# EasyEDA Pro project sony_flash.eprj

# Schematic Schematic1
Board Name: Board1; Create Date: 2025-09-22; Page Name: P1; Project Name: sony_flash; Schematic Name: Schematic1; Update Date: 2025-10-10; Company: 嘉立创EDA; Page Size: A4; Version: V1.0
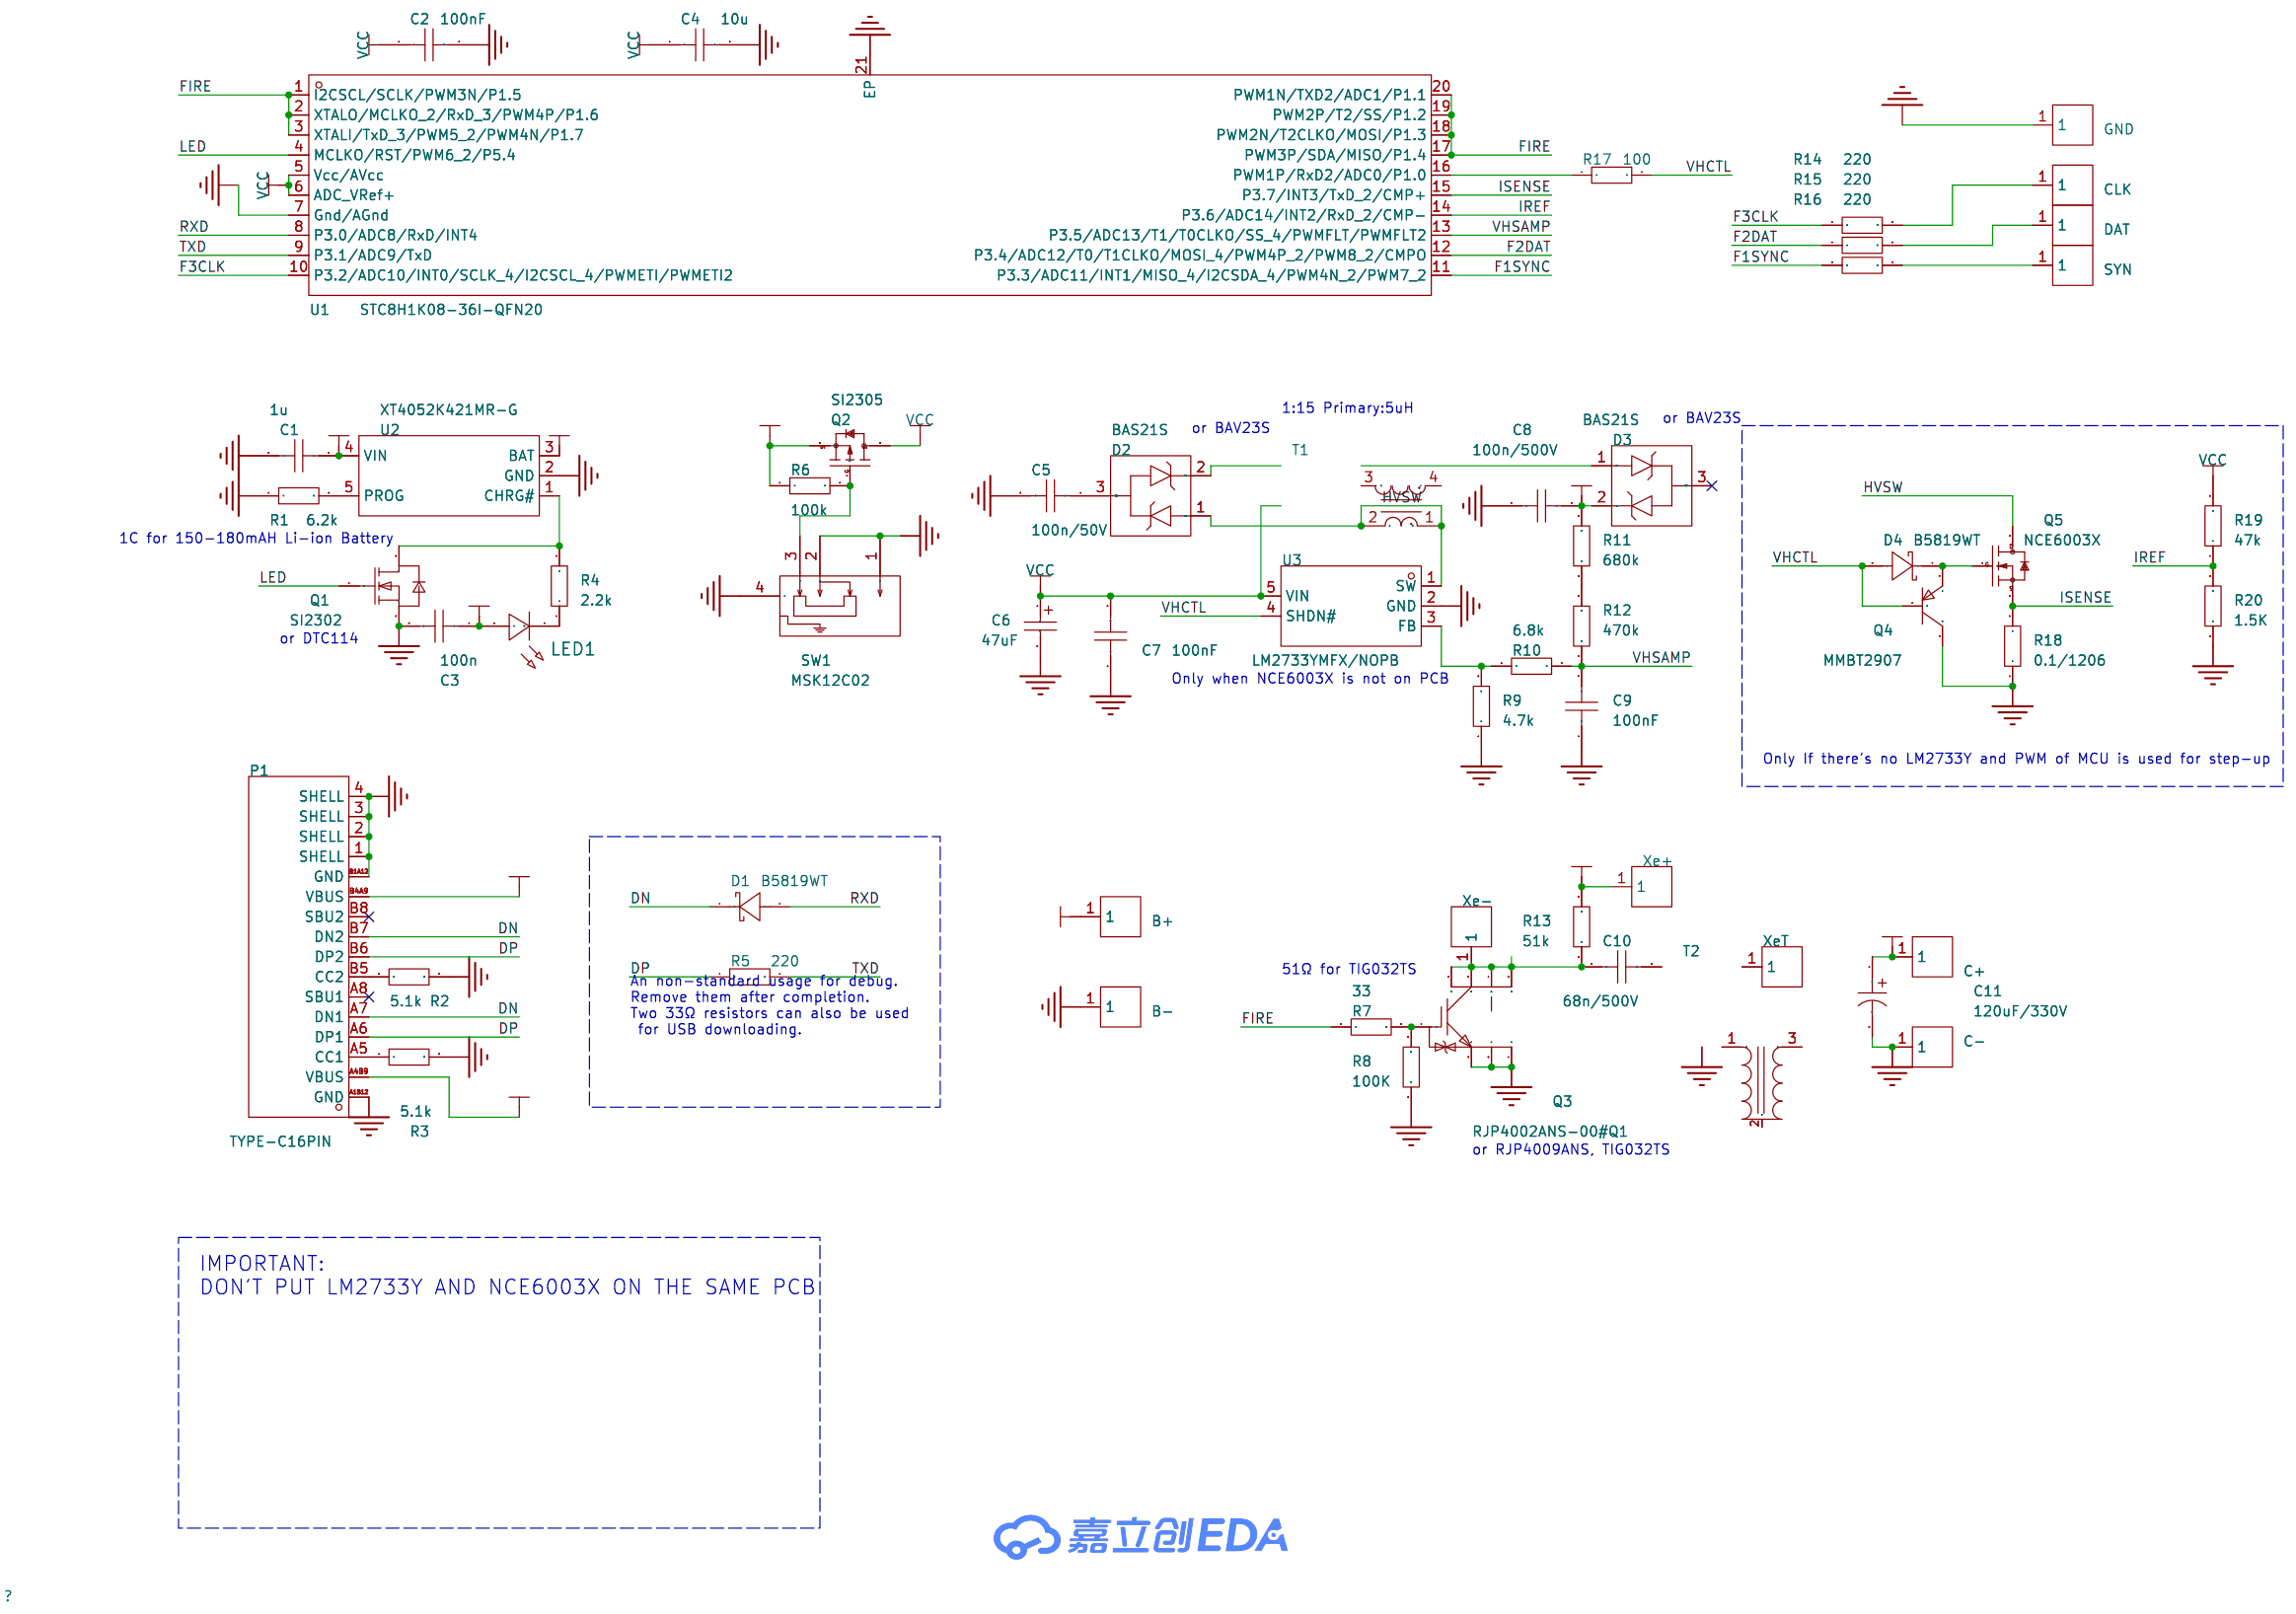
[diagram p0: schematic sheet]

## Parts
B+  PAD  [pad-1.5mm]
B-  PAD  [pad-1.5mm]
C1  1u  [C0603]
C2  100nF  [C0603]
C3  100n  [C0603]
C4  10u  [C0603]
C5  100n/50V  [C0603]
C6  47uF  [CASE-A_3216]
C7  100nF  [C0603]
C8  100n/500V  [C1206]
C9  100nF  [C0603]
C10  68n/500V  [C1206]
C11  120uF/330V  [CAP-TH_BD13.0-P5.00-D0.6-FD]
C+  PAD  [pad-1.5mm]
C-  PAD  [pad-1.5mm]
CLK  PAD  [pad-0.8x0.8]
D1  B5819WT  [SOD-523_L1.2-W0.8-LS1.6-RD]
D2  BAS21S  [SOT-23_L2.9-W1.3-P1.90-LS2.4-BL]
D3  BAS21S  [SOT-23_L2.9-W1.3-P1.90-LS2.4-BL]
D4  B5819WT  [SOD-523_L1.2-W0.8-LS1.6-RD]
DAT  PAD  [pad-0.8x0.8]
GND  PAD  [pad-0.8x0.8]
LED1  -  [LED_0603]
P1  TYPE-C16PIN  [USB-C-SMD_TYPE-C16PIN]
Q1  SI2302  [SOT-23-3_L2.9-W1.3-P0.95-LS2.4-BR]
Q2  SI2305  [SOT-23-3_L2.9-W1.3-P1.90-LS2.4-BR]
Q3  RJP4002ANS-00#Q1  [VSON-8_L4.4-W3.0-P0.65-LS4.8-BL]
Q4  MMBT2907  [SOT-23-3_L2.9-W1.3-P1.90-LS2.4-BR]
Q5  NCE6003X  [SOT-23-3_L2.9-W1.3-P1.90-LS2.4-BR]
R1  6.2k  [R0603]
R2  5.1k  [R0603]
R3  5.1k  [R0603]
R4  2.2k  [R0603]
R5  220  [R0603]
R6  100k  [R0603]
R7  33  [R0603]
R8  100K  [R0603]
R9  4.7k  [R0603]
R10  6.8k  [R0603]
R11  680k  [R0603]
R12  470k  [R0603]
R13  51k  [R0603]
R14  220  [R0603]
R15  220  [R0603]
R16  220  [R0603]
R17  100  [R0603]
R18  0.1/1206  [R1206]
R19  47k  [R0603]
R20  1.5K  [R0603]
SW1  MSK12C02  [SW-TH_MSK12C02]
SYN  PAD  [pad-0.8x0.8]
T1  -  [NA5924-AR]
T2  -  [TTRG-HF8124]
U1  STC8H1K08-36I-QFN20  [QFN-20_L3.0-W3.0-P0.40-BL-EP1.7]
U2  XT4052K421MR-G  [SOT-23-5_L2.9-W1.6-P0.95-LS2.8-BL]
U3  LM2733YMFX/NOPB  [SOT-23-5_L3.0-W1.7-P0.95-LS2.8-BL]
Xe+  PAD  [pad-1.5mm]
Xe-  PAD  [pad-1.5mm]
XeT  PAD  [pad-1.5mm]

## Library data of the parts
B+ B- C+ C- CLK DAT GND SYN Xe+ Xe- XeT = PAD: Supplier Part: C9900017271; JLCPCB Part Class: Extended Part; Supplier: LCSC
C1-C5 C7-C10 = CAP_0603: Supplier Footprint: 0603
C6 = TAJA476K006RNJ: LCSC Part Name: 47uF ±10% 6.3V; Supplier Part: C7190; Manufacturer: Kyocera AVX; Supplier Footprint: CASE-A-3216-18(mm); JLCPCB Part Class: 扩展库; Supplier: LCSC; Tolerance: ±10%; Voltage Rating: 6.3V; Equivalent Series Resistance(ESR): 1.6Ω@100kHz; Operating Temperature: -55℃~+125℃
C11 = 87EC0555: LCSC Part Name: 120uF ±20% 400V; Supplier Part: C19708144; Manufacturer: KNSCHA(科尼盛); Supplier Footprint: 插件,D13xL35mm; JLCPCB Part Class: 扩展库; Datasheet: https://item.szlcsc.com/datasheet/87EC0555/21016187.html; Supplier: LCSC; Tolerance: ±20%; Voltage Rating: 400V; Ripple Current: 750mA@120Hz; Pin Spacing: 5mm; Diameter: 13mm; Height - Seated (Max): 35mm; Lifetime: 2000hrs@105℃; Operating Temperature: -25℃~+105℃
D1 D4 = B5819WT_C7502714: LCSC Part Name: 电压:40V 电流:0.35A; Supplier Part: C7502714; Manufacturer: R+O(宏嘉诚); Supplier Footprint: SOD-523; JLCPCB Part Class: 扩展库; Datasheet: https://item.szlcsc.com/datasheet/B5819WT/8589431.html; Supplier: LCSC; Diode Configuration: 独立式; Voltage - Forward(Vf@If): 600mV@200mA; Voltage - DC Reverse(Vr): 40V; Current - Rectified: 350mA; Reverse Leakage Current (Ir): 5uA@30V; Non-Repetitive Peak Forward Surge Current: 1.5A
D2 D3 = BAS21S: Supplier Part: C2846050; Manufacturer: UMW(友台半导体); Supplier Footprint: SOT-23; JLCPCB Part Class: 扩展库; Datasheet: https://item.szlcsc.com/datasheet/BAS21S/3039891.html; Supplier: LCSC; Diode Configuration: 1对串联式; Voltage - Forward(Vf@If): 1.25V@200mA; Voltage - DC Reverse(Vr): 250V; Current - Rectified: 200mA; Pd - Power Dissipation: 225mW; Reverse Leakage Current (Ir): 100nA@200V; Reverse Recovery Time (trr): 50ns; Non-Repetitive Peak Forward Surge Current: 2.5A
LED1 = LED_0603-R: Supplier Footprint: 0603
P1 = TYPE-C16PIN: LCSC Part Name: Type-C 母 卧贴; Supplier Part: C393939; Manufacturer: SHOU HAN(首韩); Supplier Footprint: SMD; JLCPCB Part Class: 扩展库; Datasheet: https://item.szlcsc.com/datasheet/TYPE-C16PIN/372551.html; Supplier: LCSC; Connector Type: Type-C; Protocol Standard: USB 3.1; Gender: 母; Mounting Type: 卧贴; Number of Contacts: 16P; Number of Ports: 1; Current Rating-Power: 3A; Voltage Rating: 30V; Connect-Disconnect Life: 1万次; Detection color: 黑色; Operating Temperature: -40℃~+85℃
Q1 = SI2302_C9900175661: Supplier Part: C9900175661; Supplier Footprint: SOT-23; Supplier: LCSC
Q2 = SI2305_C181088: LCSC Part Name: 1个P沟道 耐压:12V 电流:4.1A; Supplier Part: C181088; Manufacturer: Hottech(合科泰); Supplier Footprint: SOT-23; JLCPCB Part Class: 扩展库; Datasheet: https://item.szlcsc.com/datasheet/SI2305/192485.html; Supplier: LCSC; Number: 1个P沟道; Drain to Source Voltage: 12V; Current - Continuous Drain(Id): 4.1A; RDS(on): 45mΩ@4.5V,3.5A; Pd - Power Dissipation: 350mW; Gate Threshold Voltage (Vgs(th)): 900mV@250uA; Gate Charge(Qg): 15nC@4.5V; Input Capacitance(Ciss): 740pF; Operating Temperature: -55℃~+150℃; Output Capacitance(Coss): 290pF
Q3 = RJP4002ANS-00#Q1: Supplier Part: C3171294; Manufacturer: RENESAS(瑞萨)/IDT; JLCPCB Part Class: 扩展库; Supplier: LCSC
Q4 = MMBT2907_C2891811: LCSC Part Name: PNP 电流:0.6A 电压:60V; Supplier Part: C2891811; Manufacturer: YONGYUTAI(永裕泰); Supplier Footprint: SOT-23; JLCPCB Part Class: 扩展库; Datasheet: https://item.szlcsc.com/datasheet/MMBT2907/3119730.html; Supplier: LCSC; type: PNP; Current - Collector(Ic): 600mA; Collector - Emitter Voltage VCEO: 60V; Pd - Power Dissipation: 225mW; DC Current Gain: 400@150mA,10V; Current - Collector Cutoff: 1uA; Vce Saturation(VCE(sat)): 400mV@150mA,15mA; Emitter-Base Voltage(Vebo): 5V; Number: 1个PNP
Q5 = NCE6003X: LCSC Part Name: 1个N沟道 耐压:60V 电流:3A; Supplier Part: C2934580; Manufacturer: NCE(无锡新洁能); Supplier Footprint: SOT-23; JLCPCB Part Class: 扩展库; Datasheet: https://item.szlcsc.com/datasheet/NCE6003X/3281457.html; Supplier: LCSC; Number: 1个N沟道; Drain to Source Voltage: 60V; Current - Continuous Drain(Id): 3A; RDS(on): 110mΩ@4.5V; Pd - Power Dissipation: 1.7W; Gate Threshold Voltage (Vgs(th)): 2V@250uA; Gate Charge(Qg): 10.2nC@10V; Operating Temperature: -55℃~+150℃; Type: N沟道
R1-R20 = Res_0603: Supplier Footprint: 0603
SW1 = MSK12C02: LCSC Part Name: 两档侧拨贴片 7脚 滑动开关; Supplier Part: C431540; Manufacturer: SHOU HAN(首韩); Supplier Footprint: SMD,8x2.8mm; JLCPCB Part Class: 扩展库; Datasheet: https://item.szlcsc.com/datasheet/MSK12C02/427897.html; Supplier: LCSC; Circuit: 单刀双掷; Termination Style: SMD接片; Length: 8mm; Width: 2.8mm; Switch Height: 1.4mm; Mounting Type: 卧贴; Current Rating: 50mA; Voltage Rating: 12V; Life: 1万次; Operating Temperature: -20℃~+70℃
T1 = NA5924-AR
T2 = TTRG-HF8124
U1 = STC8H1K08-36I-QFN20: LCSC Part Name: 宽电压/高速/高可靠/低功耗/强抗静电/较强抗干扰的新一代 8051 单片机; Supplier Part: C915674; Manufacturer: STC; Supplier Footprint: QFN-20-EP(3x3); JLCPCB Part Class: 扩展库; Datasheet: https://atta.szlcsc.com/upload/public/pdf/source/20241226/4D2D43D1C972E3DE0CD105735CEEAD95.pdf; Supplier: LCSC; CPU Core: 51系列; Program Storage Size: 8KB; Program Memory Type: FLASH; Number of I/O: 17; ADC (Bit): 10bit; PWM (Bit): 16bit; Low Voltage Detection Threshold: 1.9V~5.5V
U2 = XT4052K421MR-G: Supplier Part: C219048; Manufacturer: natlinear(南麟); Supplier Footprint: SOT-23-5L; JLCPCB Part Class: 扩展库; Supplier: LCSC
U3 = LM2733YMFX/NOPB: LCSC Part Name: 0.6至1.6MHz升压转换器，内置40V FET开关，采用SOT-23封装; Supplier Part: C527399; Manufacturer: TI(德州仪器); Supplier Footprint: SOT-23-5; JLCPCB Part Class: 扩展库; Datasheet: https://www.ti.com/cn/lit/gpn/lm2733; Supplier: LCSC; Function: 升压型; Voltage - Supply: 2.7V~14V; Output Voltage: 2.7V~40V; Output Current: 1A; Frequency - Switching: 600kHz; Operating Temperature: -40℃~+125℃@(TJ); Synchronous Rectifier: 否; Number of Outputs: 1; Topology: 升压式; Quiescent Current: 1.1mA; Switch tube (built-in/external): 内置; Output Type: 可调

## Nets
GND: B-.1 C1.2 C2.2 C3.2 C4.2 C5.2 C6.2 C7.1 C8.1 C9.1 C11.2 C-.1 GND.1 P1.1(SHELL) P1.2(SHELL) P1.3(SHELL) P1.4(SHELL) P1.A1B12(GND) P1.B1A12(GND) Q1.2(S) Q3.1(E) Q3.2(E) Q3.3(E) Q4.3(C) R1.1 R2.2 R3.2 R8.1 R9.1 R18.1 R20.1 SW1.1 SW1.2 SW1.4 U1.7(Gnd/AGnd) U1.21(EP) U2.2(GND) U3.2(GND)
VBAT: B+.1 C3.1 LED1.2(A) Q2.2(S) R6.1 U2.3(BAT)
VBUS: C1.1 P1.A4B9(VBUS) P1.B4A9(VBUS) U2.4(VIN)
VCC: C2.1 C4.1 C6.1 C7.2 Q2.3(D) R19.2 U1.5(Vcc/AVcc) U1.6(ADC_VRef+) U3.5(VIN)
DN: D1.1(K) P1.A7(DN1) P1.B7(DN2)
DP: P1.A6(DP1) P1.B6(DP2) R5.1
F1SYNC: R16.1 U1.11(P3.3/ADC11/INT1/MISO_4/I2CSDA_4/PWM4N_2/PWM7_2)
F2DAT: R15.1 U1.12(P3.4/ADC12/T0/T1CLKO/MOSI_4/PWM4P_2/PWM8_2/CMPO)
F3CLK: R14.1 U1.10(P3.2/ADC10/INT0/SCLK_4/I2CSCL_4/PWMETI/PWMETI2)
FIRE: R7.1 U1.1(I2CSCL/SCLK/PWM3N/P1.5) U1.2(XTALO/MCLKO_2/RxD_3/PWM4P/P1.6) U1.3(XTALI/TxD_3/PWM5_2/PWM4N/P1.7) U1.17(PWM3P/SDA/MISO/P1.4) U1.18(PWM2N/T2CLKO/MOSI/P1.3) U1.19(PWM2P/T2/SS/P1.2) U1.20(PWM1N/TXD2/ADC1/P1.1)
HVSW: D2.1(BASE) Q5.3(D) T1.1 T1.2 U3.1(SW)
IREF: R19.1 R20.2 U1.14(P3.6/ADC14/INT2/RxD_2/CMP-)
ISENSE: Q5.2(S) R18.2 U1.15(P3.7/INT3/TxD_2/CMP+)
LED: Q1.1(G) U1.4(MCLKO/RST/PWM6_2/P5.4)
RXD: D1.2(A) U1.8(P3.0/ADC8/RxD/INT4)
TXD: R5.2 U1.9(P3.1/ADC9/TxD)
VH: C8.2 C11.1 C+.1 D3.2(EMITTER) R11.2 R13.2 Xe+.1
VHCTL: D4.2(A) Q4.1(B) R17.2 U3.4(SHDN#)
VHSAMP: C9.2 R10.2 R12.1 U1.13(P3.5/ADC13/T1/T0CLKO/SS_4/PWMFLT/PWMFLT2)
$1N1176: P1.B5(CC2) R2.1
$1N1202: P1.A5(CC1) R3.1
$1N1568: R1.2 U2.5(PROG)
$1N2100: Q1.3(D) R4.2 U2.1(CHRG#)
$1N2340: C10.1 Q3.5(C) Q3.6(C) Q3.7(C) Q3.8(C) R13.1 Xe-.1
$1N2369: Q3.4(G) R7.2 R8.2
$1N3948: R9.2 R10.1 U3.3(FB)
$1N4269: CLK.1 R14.2
$1N4295: DAT.1 R15.2
$1N4321: R16.2 SYN.1
$1N12535: D4.1(K) Q4.2(E) Q5.1(G)
$1N13636: R11.1 R12.2
$1N13640: C5.1 D2.3(COLLECTOR)
$1N18562: LED1.1(C) R4.1
$1N23434: R17.1 U1.16(PWM1P/RxD2/ADC0/P1.0)
$1N28292: Q2.1(G) R6.2 SW1.3

Not connected (* = marked no-connect by the designer): C10 2; D2 2(EMITTER); D3 1(BASE) 3(COLLECTOR)*; P1 A8(SBU1)* B8(SBU2)*; T1 3 4; T2 1 2 3; XeT 1

## Notes on the sheet
- 1:15 Primary:5uH
- or BAV23S
- or BAV23S
- 1C for 150-180mAH Li-ion Battery
- or DTC114
- Only when NCE6003X is not on PCB
- Only If there's no LM2733Y and PWM of MCU is used for step-up
- 51Ω for TIG032TS
- An non-standard usage for debug.
  Remove them after completion.
  Two 33Ω resistors can also be used
   for USB downloading.
- or RJP4009ANS, TIG032TS
- IMPORTANT:
  DON'T PUT LM2733Y AND NCE6003X ON THE SAME PCB

# Board PCB1
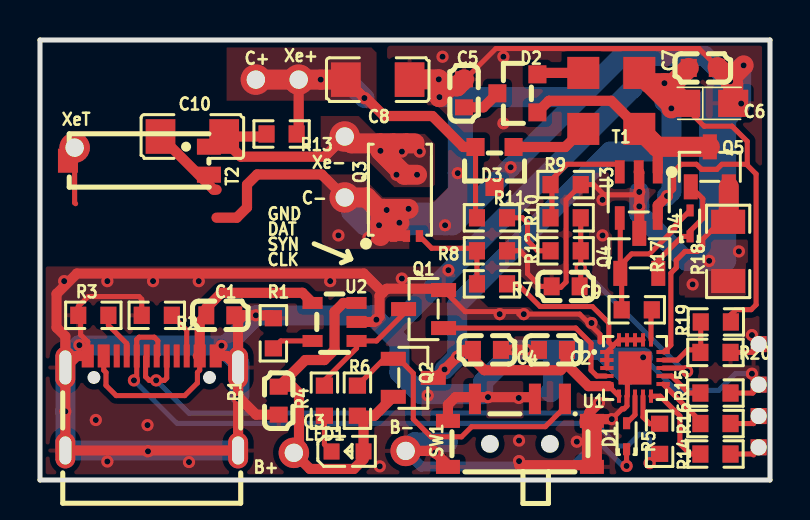
[diagram p1: board, top side]
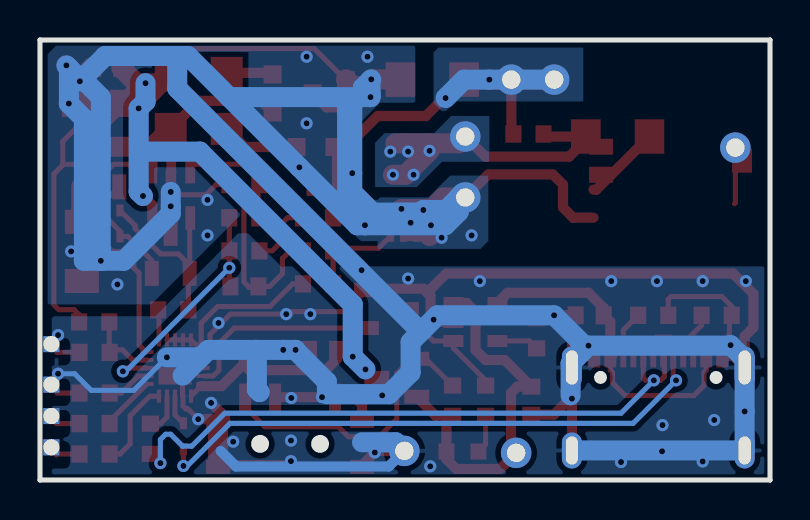
[diagram p2: board, bottom side, seen from below]

Outline 36.51 x 22 mm; copper layers: Top Layer, Bottom Layer. Coordinates in mm from the lower left corner of the outline.
Outline path: 0,22 0,0 36.51,0 36.51,22 0,22
Stack: Top Layer 0.035mm / Dielectric1 1.51mm FR4 er 4.5 / Bottom Layer 0.035mm

## Design rules (mm)
net DN: DP1
net DP: DP1
template: JLCPCB Capability(Two Layers Board)
spacing copperThickness1oz (default): track to track 0.102, other pairs 0.152 to 0.3
spacing copperThickness2oz: track to track 0.203, other pairs 0.152 to 0.3
track width copperThickness1oz (default): min 0.127, default 0.254, max 2.54
track width copperThickness2oz: min 0.203, default 0.254, max 2.54
differential pair differentialPair (default): width min 0.127, default 0.254, max 2.54; gap min 0.152, default 0.152
via viaSize (default): diameter min 0.5, default 0.61, max 10; hole min 0.3, default 0.305, max 6.3

## Placement (name value [footprint] x y rotation side)
B+  PAD  [pad-1.5mm]  12.7 1.36 0 top
B-  PAD  [pad-1.5mm]  18.29 1.45 0 top
C1  1u  [C0603]  9.02 8.23 0 top
C2  100nF  [C0603]  25.65 6.51 180 top
C3  100n  [C0603]  11.94 3.97 270 top
C4  10u  [C0603]  22.35 6.51 0 top
C5  100n/50V  [C0603]  21.21 19.33 90 top
C6  47uF  [CASE-A_3216]  33.47 18.83 0 top
C7  100nF  [C0603]  33.15 20.6 180 top
C8  100n/500V  [C1206]  16.89 20.02 180 top
C9  100nF  [C0603]  26.29 9.68 0 top
C10  68n/500V  [C1206]  7.62 17.17 180 top
C+  PAD  [pad-1.5mm]  10.79 20.02 0 top
C-  PAD  [pad-1.5mm]  15.24 14.13 0 top
CLK  PAD  [pad-0.8x0.8]  35.69 1.25 0 top
D1  B5819WT  [SOD-523_L1.2-W0.8-LS1.6-RD]  29.34 2.19 90 top
D2  BAS21S  [SOT-23_L2.9-W1.3-P1.90-LS2.4-BL]  23.88 19.33 90 top
D3  BAS21S  [SOT-23_L2.9-W1.3-P1.90-LS2.4-BL]  22.73 15.65 180 top
D4  B5819WT  [SOD-523_L1.2-W0.8-LS1.6-RD]  32.51 12.83 90 top
DAT  PAD  [pad-0.8x0.8]  35.69 4.39 0 top
GND  PAD  [pad-0.8x0.8]  35.69 6.41 0 top
LED1  -  [LED_0603]  15.43 1.43 0 top
P1  TYPE-C16PIN  [USB-C-SMD_TYPE-C16PIN]  5.59 3.84 0 top
Q1  SI2302  [SOT-23-3_L2.9-W1.3-P0.95-LS2.4-BR]  19.19 8.55 0 top
Q2  SI2305  [SOT-23-3_L2.9-W1.3-P1.90-LS2.4-BR]  18.67 5.11 180 top
Q3  RJP4002ANS-00#Q1  [VSON-8_L4.4-W3.0-P0.65-LS4.8-BL]  18 14.52 0 top
Q4  MMBT2907  [SOT-23-3_L2.9-W1.3-P1.90-LS2.4-BR]  29.97 11.33 270 top
Q5  NCE6003X  [SOT-23-3_L2.9-W1.3-P1.90-LS2.4-BR]  33.5 15.66 270 top
R1  6.2k  [R0603]  11.67 7.33 270 top
R2  5.1k  [R0603]  5.84 8.23 180 top
R3  5.1k  [R0603]  2.67 8.23 180 top
R4  2.2k  [R0603]  14.22 3.97 90 top
R5  220  [R0603]  30.99 2.06 90 top
R6  100k  [R0603]  15.88 3.97 90 top
R7  33  [R0603]  22.61 9.81 180 top
R8  100K  [R0603]  22.61 11.46 180 top
R9  4.7k  [R0603]  26.29 14.77 180 top
R10  6.8k  [R0603]  26.29 13.11 0 top
R11  680k  [R0603]  22.61 13.11 180 top
R12  470k  [R0603]  26.29 11.46 180 top
R13  51k  [R0603]  12.08 17.3 0 top
R14  220  [R0603]  33.78 1.3 0 top
R15  220  [R0603]  33.78 4.35 0 top
R16  220  [R0603]  33.78 2.82 0 top
R17  100  [R0603]  29.84 8.51 180 top
R18  0.1/1206  [R1206]  34.42 11.43 90 top
R19  47k  [R0603]  33.8 7.9 0 top
R20  1.5K  [R0603]  33.78 6.38 180 top
SW1  MSK12C02  [SW-TH_MSK12C02]  24 2.36 0 top
SYN  PAD  [pad-0.8x0.8]  35.69 2.82 0 top
T1  -  [NA5924-AR]  29.97 17.56 180 top
T2  -  [TTRG-HF8124]  8.83 14.52 180 top
U1  STC8H1K08-36I-QFN20  [QFN-20_L3.0-W3.0-P0.40-BL-EP1.7]  29.76 5.6 270 top
U2  XT4052K421MR-G  [SOT-23-5_L2.9-W1.6-P0.95-LS2.8-BL]  14.73 7.9 90 top
U3  LM2733YMFX/NOPB  [SOT-23-5_L3.0-W1.7-P0.95-LS2.8-BL]  29.94 14.25 180 top
Xe+  PAD  [pad-1.5mm]  12.94 20.02 0 top
Xe-  PAD  [pad-1.5mm]  15.24 17.17 0 top
XeT  PAD  [pad-1.5mm]  1.73 16.62 0 top

## Footprints (pads in the part's own frame, mm; a bottom-side part is the same pattern mirrored in y, then rotated)
C0603
  rect 0.8x0.9 smd: 1(-0.7,0) 2(0.7,0)
C1206
  rect 1.485x1.728 smd: 1(-1.593,0) 2(1.593,0)
CASE-A_3216
  rect 1.5x1.359 smd: 1(-1.2,0) 2(1.2,0)
LED_0603
  rect 0.8x0.8 smd: 1(-0.851,-0.01) 2(0.75,-0.005)
NA5924-AR
  rect 1.6x1.6 smd: 1(0,0) 2(0,-2.8) 3(2.8,-2.8) 4(2.8,0)
pad-0.8x0.8
  rect 0.8x0.8 hole 0.914x0.5: 1(0.254,0.381)
pad-1.5mm
  round 1.524 hole 0.914x0.7: 1(0,0)
QFN-20_L3.0-W3.0-P0.40-BL-EP1.7
  rect 0.2x0.665 smd: 1(-0.8,-1.407) 2(-0.4,-1.407) 3(0,-1.407) 4(0.4,-1.407) 5(0.8,-1.407) 11(0.8,1.407) 12(0.4,1.407) 13(0,1.407) 14(-0.4,1.407) 15(-0.8,1.407)
  rect 0.665x0.2 smd: 6(1.407,-0.8) 7(1.407,-0.4) 8(1.407,0) 9(1.407,0.4) 10(1.407,0.8) 16(-1.407,0.8) 17(-1.407,0.4) 18(-1.407,0) 19(-1.407,-0.4) 20(-1.407,-0.8)
  rect 1.65x1.65 smd: 21(0,0)
R0603
  rect 0.806x0.864 smd: 1(-0.753,0) 2(0.753,0)
R1206
  rect 1.208x1.701 smd: 1(-1.479,0) 2(1.479,0)
SOD-523_L1.2-W0.8-LS1.6-RD
  rect 0.6x0.36 smd: 1(-0.65,0) 2(0.65,0)
SOT-23-3_L2.9-W1.3-P0.95-LS2.4-BR
  rect 1.25x0.7 smd: 1(1,-0.95) 2(1,0.95) 3(-1,0)
SOT-23-3_L2.9-W1.3-P1.90-LS2.4-BR
  rect 1.25x0.7 smd: 1(1,-0.95) 2(1,0.95) 3(-1,0)
SOT-23-5_L2.9-W1.6-P0.95-LS2.8-BL
  rect 0.6x1 smd: 1(-0.95,-1.1) 2(0,-1.1) 3(0.95,-1.1) 4(0.95,1.1) 5(-0.95,1.1)
SOT-23-5_L3.0-W1.7-P0.95-LS2.8-BL
  rect 0.49x1.157 smd: 1(-0.95,-1.153) 2(0,-1.153) 3(0.95,-1.153)
  rect 0.49x1.175 smd: 4(0.95,1.153) 5(-0.95,1.153)
SOT-23_L2.9-W1.3-P1.90-LS2.4-BL
  rect 0.9x0.9 smd: 1(-0.95,-1) 2(0.95,-1) 3(0,1)
SW-TH_MSK12C02
  rect 0.6x1.524 smd: 1(-2.25,1.7) 2(0.75,1.7) 3(2.25,1.7)
  rect 1.2x0.7 smd: 4(-3.6,0.6) 4(-3.6,-1.7) 4(3.6,0.6) 4(3.6,-1.7)
TTRG-HF8124
  rect 1.2x0.8 smd: 1(0.381,-2.15) 2(0.381,-0.75)
  rect 1x1.2 smd: 3(7.431,-1.45)
USB-C-SMD_TYPE-C16PIN
  oval 1x2.1 hole 0.6x1.7: 1(-4.32,1.788) 2(4.32,1.788)
  oval 1x1.8 hole 0.6x1.4: 3(-4.32,-2.362) 4(4.32,-2.362)
  rect 0.6x1.15 smd: A1B12(-3.2,2.362) A4B9(-2.4,2.362) B1A12(3.2,2.362) B4A9(2.4,2.362)
  rect 0.3x1.15 smd: A5(-1.25,2.362) A6(-0.25,2.362) A7(0.25,2.362) A8(1.25,2.362) B5(1.75,2.362) B6(0.75,2.362) B7(-0.75,2.362) B8(-1.75,2.362)
VSON-8_L4.4-W3.0-P0.65-LS4.8-BL
  rect 0.364x0.585 smd: 1(-0.975,-2.317) 2(-0.325,-2.317) 3(0.325,-2.317) 4(0.975,-2.317) 5(0.975,2.317) 6(0.325,2.317) 7(-0.325,2.317) 8(-0.975,2.317)

## Nets
As in the schematic, except:
GND: B-.1 C1.2 C2.2 C3.2 C4.2 C5.2 C6.2 C7.1 C8.1 C9.1 C-.1 GND.1 P1.1 P1.2 P1.3 P1.4 P1.A1B12 P1.B1A12 Q1.2 Q3.1 Q3.2 Q3.3 Q4.3 R1.1 R2.2 R3.2 R8.1 R9.1 R18.1 R20.1 SW1.1 SW1.2 SW1.4 T2.2 U1.7 U1.21 U2.2 U3.2
VCC: C2.1 C4.1 C6.1 C7.2 Q2.3 R19.2 T1.2 U1.5 U1.6 U3.5
HVSW: D2.1 Q5.3 T1.1 U3.1
$1N2434: C10.2 T2.1
$1N2546: T2.3 XeT.1
$1N3080: D3.1 T1.4
$1N3540: D2.2 T1.3

Pads without a net: D3 3; P1 A8 B8

## Via types
v1: diameter 0.61, hole 0.305, Top Layer to Bottom Layer, 78 vias

## Routing (per net, layer and track width the routed paths; a pad name or vN(x,y) marks a point on that pad's centre or on a via; arc(x,y) is an arc through that point)
GND: length 313.5
  Top Layer w0.254: 34.05,20.48 34.48,20.48 ; R20.1 35.65,6.38 35.69,6.41 ; 28.01,6.9 28.01,7.28 26.99,8.29 24.07,8.29 ; P1.A1B12 2.39,6.91 2.03,7.27 2.03,8.12 R3.2 1.91,8.67 2.41,9.17 4.95,9.17 5.09,9.04 R2.2 ; U1.21 29.38,5.22 29.38,4.21 U1.7 29.36,3.7 29.21,3.56 29.11,3.56 v1(28.6,3.04) ; 24.07,8.29 24.2,8.42 21.26,8.42 Q1.2 ; 24.07,8.29 23.94,8.29 ; R8.1 24,11.46 24.38,11.08 24.38,10.32 25.02,9.68 C9.1 25.63,9.64 26.05,9.64 26.31,9.9 26.31,14.01 27.04,14.74 R9.1 27.7,14.77 28.21,14.26 29.83,14.26 v1(29.97,14.4) ; 21.26,20.03 22.8,21.57 32.96,21.57 33.89,20.64
  Top Layer w0.508: 24.75,4.14 v1(22.41,4.14) 20.78,4.14 20.4,3.77 20.4,3.04 ; v1(28.6,3.04) 27.6,3.04 27.48,2.92 27.48,3.38 v1(27.95,3.85) ; 17.15,9.37 16.98,9.2 16.98,8.17 v1(16.82,8.02) 16.71,7.9 U2.2 ; 17.15,9.37 17.34,9.56 20.12,9.56 Q1.2 ; 17.15,9.37 16.19,10.32 1.84,10.32 0.83,9.31 0.83,7.62 1.27,7.18 P1.1 ; P1.2 9.91,4.17 ; P1.2 9.33,6.2 P1.B1A12 ; P1.2 9.91,7.97 10.18,8.23 ; 9.91,4.17 P1.4 P1.3 v1(1.27,3.43) P1.1 ; 9.91,4.17 10.81,3.27 C3.2 ; 10.18,8.23 C1.2 ; 10.18,8.23 v1(10.8,8.23) 11.53,8.23 R1.1 ; Q4.3 v1(29.97,13.68) v1(29.97,14.4) 29.97,15.38 U3.2 ; C-.1 14.09,15.28 10.86,15.28 10.35,14.77 10.35,13.63 9.84,13.12 8.83,13.12 ; 33.47,10.9 v1(33.47,10.96) ; 23.96,0.74 27.6,0.74 ; 20.4,0.74 19.69,1.45 B-.1 ; P1.1 1.84,6.2 P1.A1B12 ; 16.79,12.2 Q3.1 18.09,12.2 ; 17.15,12.55 17.03,12.67 ; v1(24.34,6.51) v1(23.73,6.51) C4.2
  Top Layer w1: v1(17.97,12.86) 17.03,12.86 17.03,12.87 ; 27.48,2.92 27.6,2.79 27.6,0.8 ; 17.03,12.87 Q3.1 ; 17.03,12.87 17.03,13.43 ; 17.03,13.43 16.33,14.13 C-.1 ; 17.03,13.43 17.15,13.56 v1(18.43,13.56) ; C5.2 20.86,19.69 20.49,19.69 20.11,19.3 20.11,19.27 v1(19.98,19.14) 19.98,20 v1(19.94,20.03) 18.5,20.03 C8.1 ; C6.2 34.67,19.78 v1(34.52,19.93) 34.52,20.02 ; 34.52,20.02 33.89,20.64 ; 34.52,20.02 34.52,20.06 v1(35.19,20.73) ; 34.52,20.02 34.56,19.97
  Bottom Layer w0.254: 1.97,6.33 v1(1.97,6.74) ; v1(30.17,6.13) 31.82,4.48 33.95,4.48 34.78,5.31 v1(35.61,5.31)
  Bottom Layer w0.508: 27.48,1.45 26.69,0.67 19.07,0.67 B-.1
  Bottom Layer w1: v1(30.17,6.13) 28.46,6.13 ; 28.46,6.13 29.38,5.22 ; 28.46,6.13 28.09,6.51 25.73,6.51 ; 34.39,20.06 33.47,19.14 v1(33.47,10.96) ; 34.39,20.06 34.52,20.06 35.07,20.61 ; 34.39,20.06 33.25,21.2 29.65,21.2 ; 34.39,20.06 v1(34.52,19.93) ; 20.36,19.62 20.36,19.36 20.58,19.14 ; 20.36,19.62 19.98,20 ; 20.36,19.62 19.98,19.24 ; 20.89,18.83 21.15,18.58 21.15,13.63 v1(20.26,12.74) ; 20.89,18.83 v1(20.89,15.34) 20.89,14.39 19.88,13.37 17.47,13.37 v1(17.34,13.5) 16.2,13.5 15.57,14.13 ; 20.89,18.83 20.58,19.14 ; v1(9.08,6.72) 9.97,5.82 9.97,4.23 ; v1(9.08,6.72) 9.28,6.72 v1(10.8,8.23) 16.64,8.23 17.38,7.49 ; v1(9.08,6.72) 2,6.72 v1(1.97,6.74) 1.27,6.04 v1(1.27,3.43) P1.3 P1.4 ; 17.38,7.49 17.56,7.49 29.65,19.58 29.65,21.2 ; 17.38,7.49 17.97,6.9 17.97,5.37 19.05,4.29 22.16,4.29 22.16,4.92 23.73,6.48 v1(23.73,6.51) v1(24.34,6.51) 25.73,6.51 ; 15.57,14.13 15.57,13.41 16.24,12.74 v1(16.96,12.74) v1(20.26,12.74) ; 15.57,14.13 C-.1 ; 35.07,20.61 v1(35.19,20.73) ; 35.07,20.61 v1(35.07,18.82) 34.32,18.07 34.32,10.96 v1(33.47,10.96) ; v1(33.47,10.96) 32.32,10.96 29.97,13.31 v1(29.97,13.68) v1(29.97,14.4) ; 19.98,20 19.98,19.24 ; 19.98,20 v1(19.94,20.03) ; 19.98,19.24 v1(19.98,19.14) 20.58,19.14 ; 29.65,21.2 29.1,21.2 27.05,19.14 ; 25.73,6.51 25.66,6.44 25.66,4.53 25.53,4.4 25.53,4.4 ; 20.58,19.14 27.05,19.14 ; v1(20.26,12.74) 20.64,12.74 v1(23.54,15.64) 27.05,19.14 ; B-.1 18.72,1.89 20.4,1.89
  vias: v1(1.21,9.94) v1(2.79,3) v1(3.37,9.94) v1(3.37,0.93) v1(5.38,2.75) v1(5.4,1.43) v1(5.65,9.94) v1(7.45,0.9) v1(7.94,9.94) v1(9.91,4.07) v1(14.51,9.94) v1(14.93,12.23) v1(16.43,12.12) v1(16.99,0.68) v1(18.1,10.07) v1(19.4,4.23) v1(19.77,1.38) v1(20.13,21.16) v1(20.43,10.49) v1(22.99,8.29) v1(23.18,21.16) v1(23.18,17.83) v1(23.94,4.1) v1(23.96,1.97) v1(23.96,0.94) v1(24.2,8.29) v1(26.85,1.92) v1(27.58,7.85) v1(28.13,14.01) v1(28.13,12.23) v1(32.64,9.78) v1(34.95,11.43) v1(35.61,7.25)
VBAT: length 19.5
  Top Layer w0.508: 15.83,8.85 15.17,8.85 14.73,8.41 14.73,6.51 14.22,6 13.27,6 C3.1 12.63,4.67 12.95,4.35 12.95,1.62 B+.1 13.5,0.55 15.7,0.55 16.18,1.04 LED1.2 16.18,2.91 R6.1 16.72,3.21 17.67,4.16
VBUS: length 16.4
  Top Layer w0.254: P1.A4B9 3.19,5.49 3.3,5.38 3.3,4.73 3.81,4.22 7.24,4.22 7.87,4.86 7.87,5.38 7.99,5.49 P1.B4A9
  Top Layer w0.508: 7.89,6.2 P1.B4A9 7.99,7.91 C1.1 8.32,8.6 9.08,9.36 13.12,9.36 13.63,8.85
VCC: length 62.6
  Top Layer w0.254: 35.33,15.79 35.81,15.3 35.81,8.76 35.57,8.52 34.81,8.52 34.55,8.26 R19.2 ; 35.33,15.79 34.1,15.79 33.85,15.53 33.09,15.53 32.83,15.79 32.07,15.79 31.69,15.4 31.69,14.53 v1(31.36,14.2) ; 35.33,15.79 35.37,15.83 35.37,16.93 34.61,17.69 33.21,17.69 32.21,18.7 32.27,18.76 C6.1 ; 28.53,4.62 U1.6 ; 28.46,4.69 U1.5
  Top Layer w0.508: 26.29,5.83 27.43,4.69 28.46,4.69 ; 26.29,5.83 26.29,6.03 26.35,6.1 C2.1 ; 26.29,5.83 26.29,5.74 26.03,5.49 22.22,5.49 21.65,6.06 C4.1 21.21,6.51 v1(20.87,6.17) v1(20.23,5.53) 19.81,5.11 Q2.3 ; v1(31.36,14.2) 30.9,13.74 30.9,13.1
  Top Layer w1: C7.2 31.69,19.84 v1(31.23,19.84) 30.49,19.84 ; 30.49,19.84 31.58,18.75 ; 30.49,19.84 T1.2 ; 31.58,18.75 v1(31.58,18.58) ; 31.58,18.75 31.58,19.53 ; 31.56,19.54 31.58,19.53 ; 31.58,19.53 C6.1
  Bottom Layer w1: v1(31.36,14.2) 31.58,14.42 v1(31.58,18.58) 31.23,18.93 v1(31.23,19.84) ; 31.31,16.42 28.51,16.42 20.87,8.77 v1(20.87,6.17) v1(20.23,5.53)
DN: length 31.1
  Top Layer w0.254: v1(4.7,4.98) 4.84,5.12 P1.B7 4.84,7.03 4.95,7.14 5.72,7.14 5.89,6.96 5.89,6.26 P1.A7 ; D1.1 29.34,0.92
  Bottom Layer w0.254: v1(4.7,4.98) 6.85,2.83 27.01,2.83 29.14,0.7 v1(29.34,0.7)
DP: length 30.9
  Top Layer w0.254: P1.A6 5.28,6.14 5.28,5.16 5.46,4.98 v1(5.81,4.98) 6.22,4.98 6.34,5.1 P1.B6
  Bottom Layer w0.254: v1(30.49,0.84) 30.49,2.02 30.23,2.29 29.97,2.29 29.38,1.69 28.91,1.69 27.27,3.34 7.45,3.34 v1(5.81,4.98)
F1SYNC: length 2.7
  Top Layer w0.254: U1.11 33.03,2.93 R16.1
F2DAT: length 2.2
  Top Layer w0.254: R15.1 32.44,4.35 31.59,5.2 U1.12
F3CLK: length 4.5
  Top Layer w0.254: U1.10 31.02,4.19 32,3.2 32,1.81 32.51,1.3 R14.1
FIRE: length 10
  Top Layer w0.254: 28.64,6.69 U1.1 U1.2 U1.3 ; 28.64,6.69 U1.20 U1.19 U1.18 U1.17 ; 28.64,6.69 28.45,6.89 28.45,7.85 27.63,8.67 25.01,8.67 23.88,9.81 R7.1
HVSW: length 11
  Top Layer w0.508: T1.1 28.57,18.96 25.45,18.96 D2.1 ; 30.9,15.41 30.9,16.63
  Top Layer w1: T1.1 30.87,16.66 Q5.3
IREF: length 3.7
  Top Layer w0.254: R19.1 33.05,6.4 ; 33.05,6.4 32.94,6.51 32.38,6.51 31.88,6 U1.14 ; 33.05,6.4 R20.2
ISENSE: length 10.2
  Top Layer w0.254: 31.2,6.4 31.55,6.75 31.55,10.34 31.82,10.61 31.82,10.99 32.26,11.43 32.89,11.43 33.15,11.68 33.15,12.04 34.01,12.91 R18.2
  Top Layer w1: R18.2 34.45,12.94 Q5.2
LED: length 9.9
  Top Layer w0.254: Q1.1 26.8,7.6 27.56,6.83 27.56,5.49 27.85,5.2 28.31,5.2
RXD: length 1.5
  Top Layer w0.254: U1.8 29.76,3.26 D1.2
TXD: length 2
  Top Layer w0.254: R5.2 30.49,2.81 30.16,3.15 U1.9
VH: length 24.8
  Top Layer w0.254: R11.2 21.78,13.18 D3.2
  Top Layer w0.508: R13.2 12.84,17.33 12.94,17.43 Xe+.1 ; 15.3,19.9 C8.2 ; 15.3,19.9 15.43,19.9 v1(16.23,19.1) 16.31,19.1 17.21,18.2 19.62,18.2 21.17,16.65 D3.2 ; 15.3,19.9 15.3,19.79
  Top Layer w1: 15.3,19.9 15.18,20.02 v1(14.04,20.02) Xe+.1 C+.1
  Bottom Layer w1: C+.1 Xe+.1 v1(14.04,20.02) 15.3,20.02 v1(16.23,19.1)
VHCTL: length 9.3
  Top Layer w0.254: D4.2 31.75,12.72 31.75,12.57 30.48,11.3 29.59,11.3 29.02,10.73 ; 29.02,10.73 29.02,13.07 U3.4 ; 29.02,10.73 Q4.1 29.09,10.26 R17.2
VHSAMP: length 12.3
  Top Layer w0.254: v1(32.37,5.43) 32.37,5.49 32.26,5.6 U1.13 ; R10.2 R12.1 v1(27.04,10.61) 27.04,9.68 C9.2
  Bottom Layer w0.254: v1(32.37,5.43) 32.22,5.43 v1(27.04,10.61)
$1N1176: length 2.3
  Top Layer w0.254: P1.B5 7.34,7.49 R2.1
$1N1202: length 2.4
  Top Layer w0.254: P1.A5 4.34,6.82 3.42,7.74 R3.1
$1N1568: length 2.1
  Top Layer w0.254: R1.2 12.04,6.95 U2.5
$1N2100: length 6.1
  Top Layer w0.254: R4.2 14.22,4.98 15.83,6.59 U2.1 16.83,6.95 18.19,8.31 Q1.3
$1N2340: length 15
  Top Layer w0.508: 9.54,17.17 11.2,17.17 R13.1 ; 9.54,17.17 9.54,16.67 10.05,16.17 14.23,16.17 Xe-.1 ; 9.54,17.17 C10.1
  Top Layer w1: v1(18.86,15.26) 18.22,15.26 v1(17.03,16.46) ; 18.74,16.83 Q3.6 Q3.8 15.58,16.83 Xe-.1
  vias: v1(17.83,15.26) v1(18.1,16.42) v1(18.99,16.42)
$1N2369: length 4.8
  Top Layer w0.254: Q3.4 19.59,11.59 21.73,11.59 R8.2 R7.2
$1N2434: length 3.9
  Top Layer w0.508: C10.2 8.69,14.52 8.83,14.52
$1N2546: length 2.8
  Top Layer w0.254: XeT.1 1.73,13.86 1.78,13.82
$1N3080: length 3.9
  Top Layer w0.508: T1.4 26.27,16.65 D3.1
$1N3540: length 2.3
  Top Layer w0.508: T1.3 24.95,20.36 D2.2
$1N3948: length 5.6
  Top Layer w0.254: R10.1 25.6,13.18 25.6,15.03 26.36,15.79 28.9,15.79
$1N4269: length 1.2
  Top Layer w0.254: R14.2 35.64,1.3 35.69,1.25
$1N4295: length 1.2
  Top Layer w0.254: 35.69,4.39 35.65,4.35 R15.2
$1N4321: length 1.2
  Top Layer w0.254: R16.2 35.68,2.82 35.69,2.82
$1N12535: length 5.7
  Top Layer w0.254: Q4.2 30.92,10.98 32.12,12.18 D4.1 32.51,12.45 33.15,13.08 33.15,14.06 Q5.1
$1N13636: length 3.4
  Top Layer w0.254: R12.2 24.89,11.46 24.38,11.97 24.38,12.86 24.13,13.11 R11.1
$1N13640: length 2
  Top Layer w0.508: D2.3 22.18,18.63 C5.1
$1N18562: length 1.9
  Top Layer w0.254: LED1.1 14.22,1.78 R4.1
$1N23434: length 1.3
  Top Layer w0.254: U1.16 30.56,8.35
$1N28292: length 15
  Top Layer w0.254: R6.2 17.21,6.06 Q2.1 17.94,6.06 18.67,5.33 18.67,3.05 19.56,2.16 21.08,2.16 21.59,2.67 25.27,2.67 26.25,3.65 26.25,4.14

## Copper pours and planes (outline as drawn; the poured copper is in the pictures)
GND on Top Layer: 20.39,10.71 22.42,8.67 36.01,8.67 36.01,0.16 35.88,0.04 0,0.04 0,10.64 0.07,10.71
GND on Top Layer: 36.13,9.44 35.9,9.2 23.88,9.2 23.4,9.68 22.68,9.68 20.9,11.59 20.13,11.72 20.13,11.73 18.74,11.73 18.74,14.01 19.75,14.01 20.39,14.64 20.39,17.42 20.39,17.43 19.12,18.71 17.34,18.71 17.34,21.63 17.59,21.88 36.01,21.88 36.13,21.75
GND on Top Layer: 14.09,15.28 19.63,15.28 19.63,11.55 14.09,11.55
GND on Top Layer: 32.25,11.89 35.31,11.89 35.31,9.12 32.25,9.12
GND on Bottom Layer: 14.09,15.22 19.62,15.22 19.62,11.55 14.09,11.55
GND on Bottom Layer: 0.19,10.71 24.33,10.71 24.38,10.65 26.09,12.36 26.61,12.36 30.75,8.22 35.83,8.22 35.95,8.1 35.95,0 0.25,0 0.19,0.05
GND on Bottom Layer: 18.86,14.01 18.93,14.03 20.02,14.03 20.51,14.52 20.51,17.82 19.5,18.83 17.72,18.83 17.72,21.88 35.58,21.88 36.15,21.31 36.15,8.75 30.94,8.75 25.93,13.75 25.72,13.75 31.23,19.26 31.23,19.58 31.22,19.58 28.14,19.58 20.47,11.92 18.94,11.92 18.86,12.79
VH on Top Layer: 9.33,21.63 16.83,21.63 16.83,18.58 9.33,18.58
VH on Bottom Layer: 9.33,21.63 16.83,21.63 16.83,18.45 9.33,18.45
$1N2340 on Top Layer: 14.04,18.2 19.75,18.2 19.75,14.64 14.04,14.64
$1N2340 on Bottom Layer: 14.04,18.2 19.75,18.2 19.75,14.64 14.04,14.64
